# EasyEDA schematic SCH_Trabalho-AP1-Somador_2024-10-15.json
TITLE: Daniel Studart, Davi Jacob e João Paulo Dopcke; REV: 1.0; Date: 2024-08-28; Sheet: 1/1; Company: IBMEC
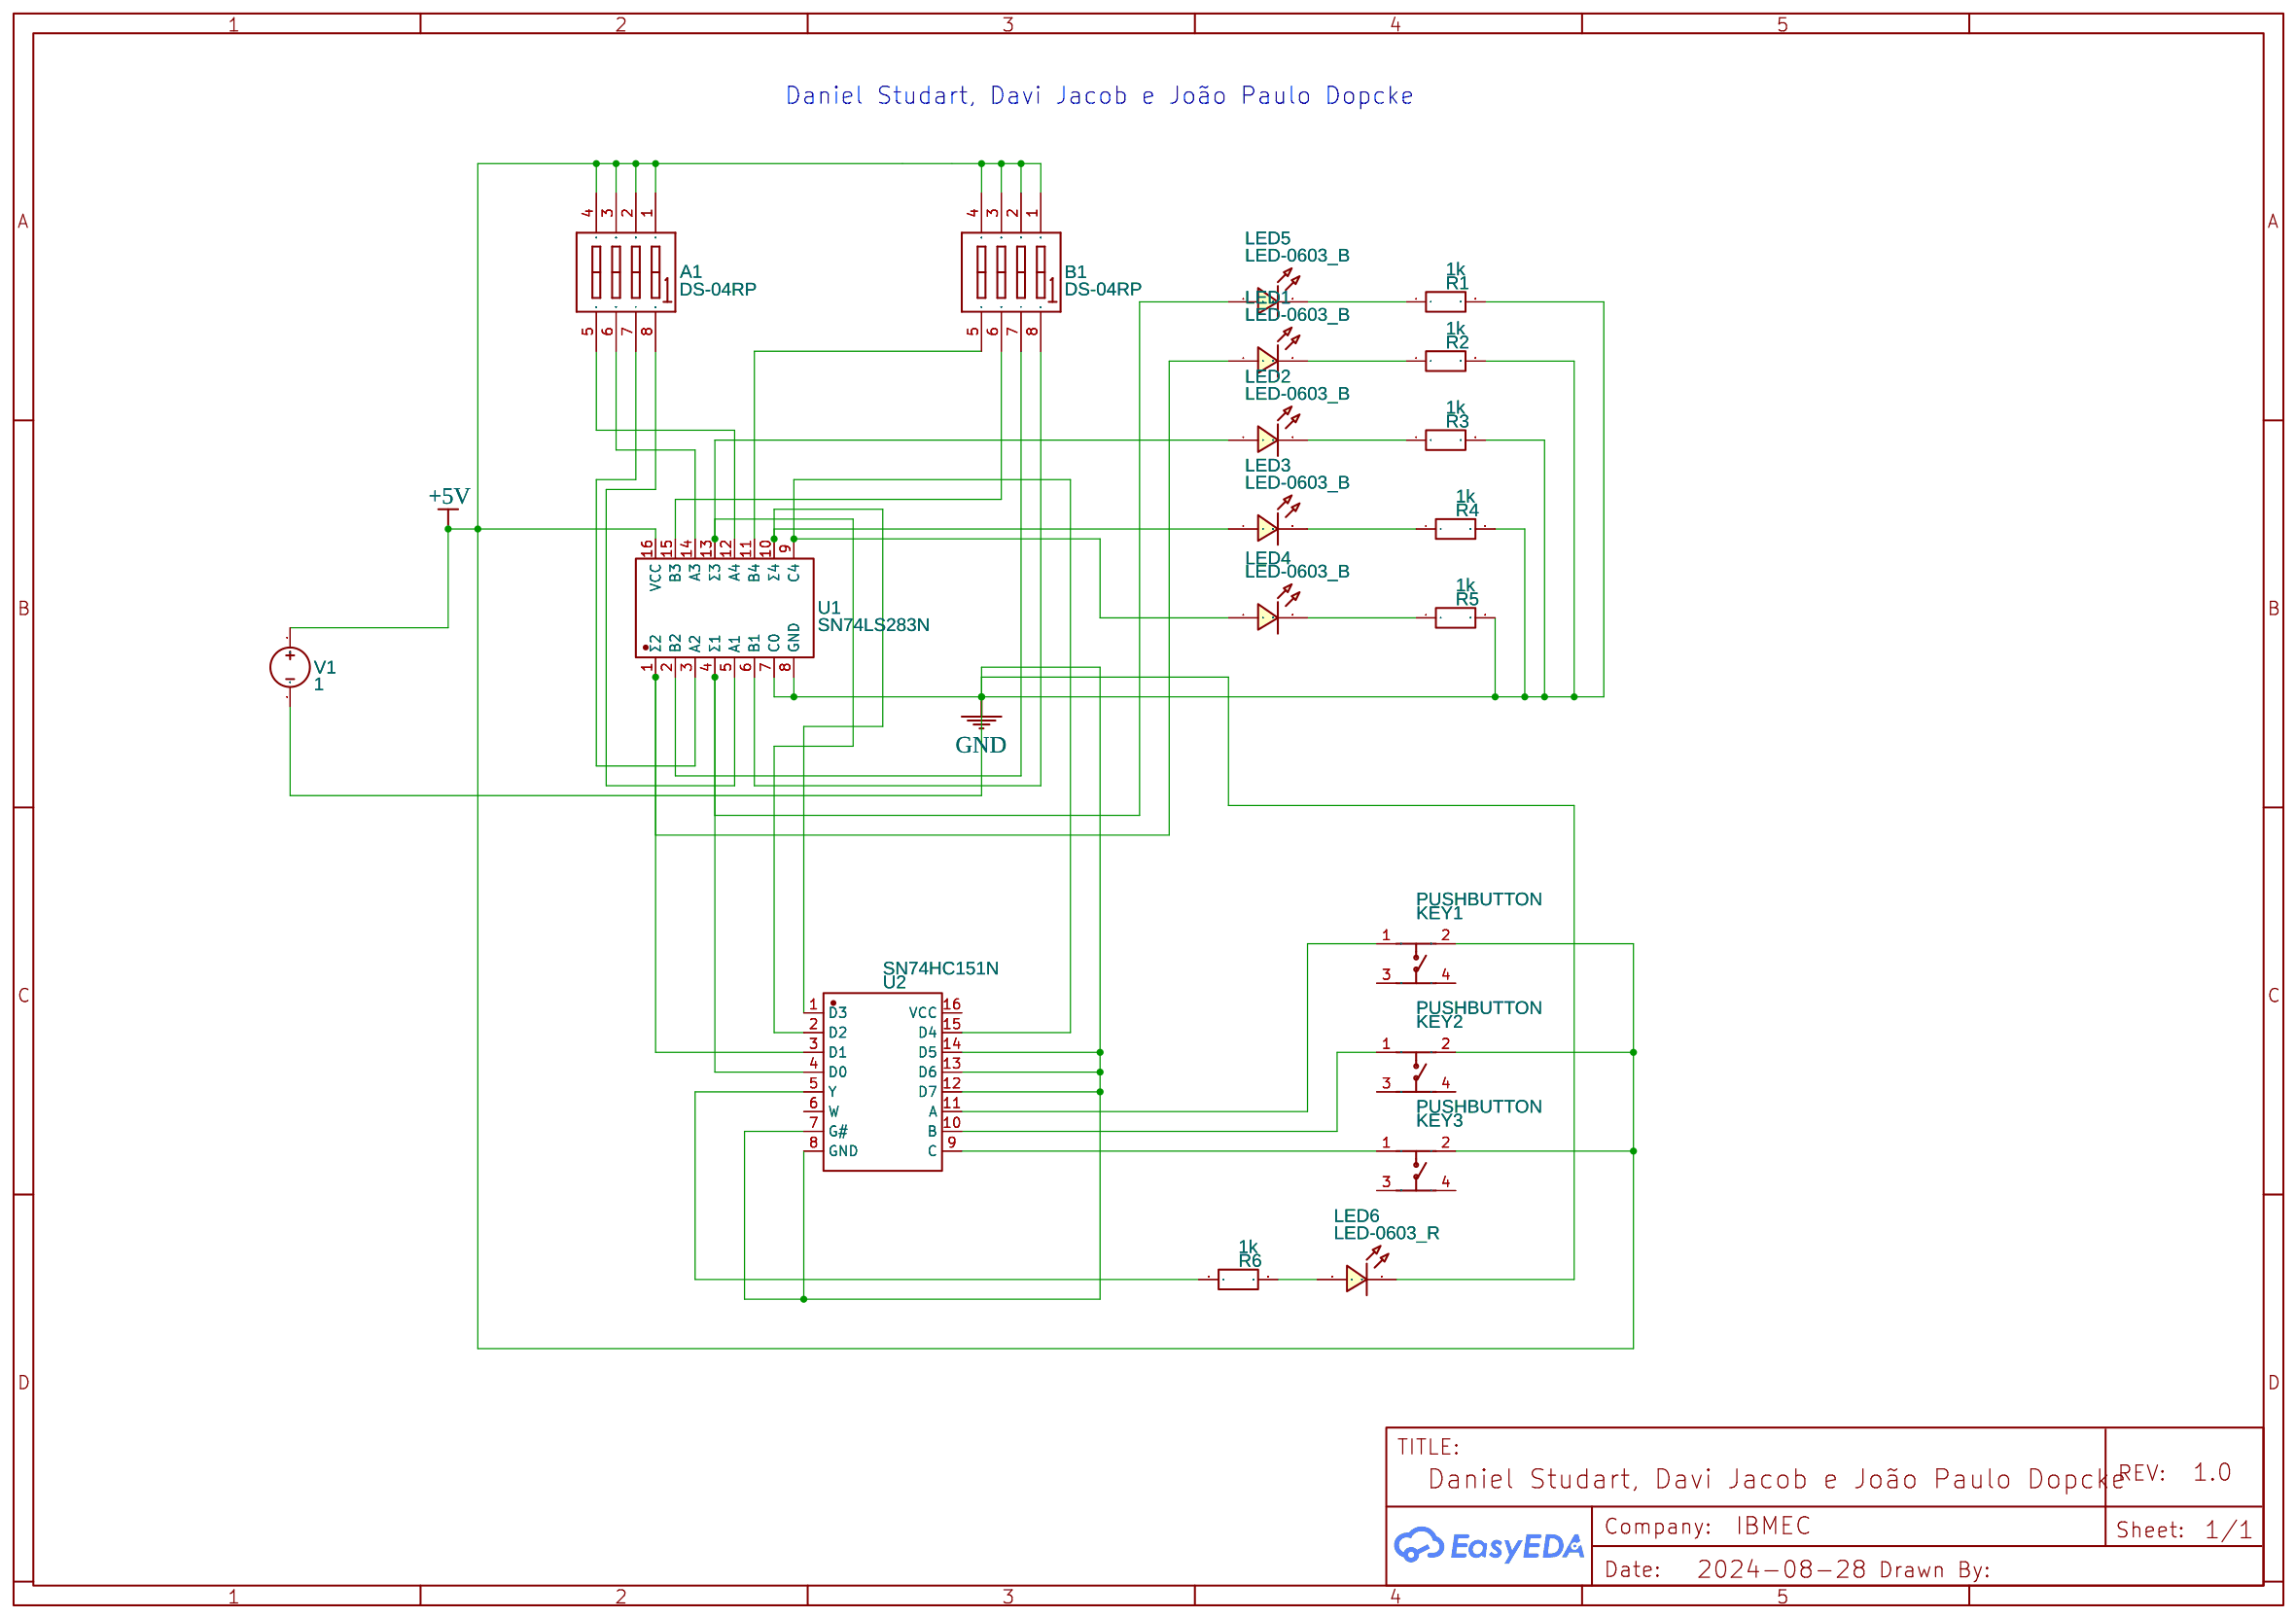
[diagram p0: schematic sheet]

## Parts
A1  DS-04RP  [SW-TH_DS-04XP]
B1  DS-04RP  [SW-TH_DS-04XP]
KEY1  PUSHBUTTON  [SW-SMD_4P-L6.0-W6.0-P4.50-LS10.0_TL3301EF160QG]
KEY2  PUSHBUTTON  [SW-SMD_4P-L6.0-W6.0-P4.50-LS10.0_TL3301EF160QG]
KEY3  PUSHBUTTON  [SW-SMD_4P-L6.0-W6.0-P4.50-LS10.0_TL3301EF160QG]
LED1  LED-0603_B  [LED0603_BLUE]
LED2  LED-0603_B  [LED0603_BLUE]
LED3  LED-0603_B  [LED0603_BLUE]
LED4  LED-0603_B  [LED0603_BLUE]
LED5  LED-0603_B  [LED0603_BLUE]
LED6  LED-0603_R  [LED0603_RED]
R1  1k  [R0603]
R2  1k  [R0603]
R3  1k  [R0603]
R4  1k  [R0603]
R5  1k  [R0603]
R6  1k  [R0603]
U1  SN74LS283N  [PDIP-16_L19.3-W6.4-P2.54-LS7.94-BL]
U2  SN74HC151N  [PDIP-16_L19.7-W6.6-P2.54-LS7.8-BL]
V1  1  [HDR1X2]

## Library data of the parts
A1 B1 = DS-04RP: Supplier: LCSC; Manufacturer: 韩国韩荣; Supplier Part: C92645; JLCPCB Part Class: Extended Part
KEY1-KEY3 = 4PINTACTPCBTHTPUSHBUTTON: Contributor: LCSC; Supplier: LCSC; Supplier Part: C9900003768; Manufacturer: null; Manufacturer Part: 4pinTACTPCBTHTPushButton; JLCPCB Part Class: Extended Part
LED1-LED5 = LED-0603_B: Manufacturer: EVERLIGHT(台湾亿光); Manufacturer Part: 19-217/BHC-ZL1M2RY/3T; Supplier Part: C72041; Supplier: LCSC; Contributor: LCEDA_01
LED6 = LED-0603_R: Manufacturer: EVERLIGHT(台湾亿光); Manufacturer Part: 19-217/R6C-AL1M2VY/3T; Supplier Part: C72044; Supplier: LCSC; Contributor: LCEDA_01
R1-R6 = R_0603_EU: Contributor: LCEDA_Lib
U1 = SN74LS283N: Contributor: LCSC; Supplier: LCSC; Supplier Part: C1523494; Manufacturer: TI(德州仪器); JLCPCB Part Class: Extended Part
U2 = SN74HC151N: Contributor: LCSC; Supplier: LCSC; Supplier Part: C157528; Manufacturer: TI(德州仪器)
V1 = VDC: Contributor: EasyEDA; sim: true

## Nets
+5V: A1.1(A1) A1.2(A2) A1.3(A3) A1.4(A4) B1.1(A1) B1.2(A2) B1.3(A3) B1.4(A4) KEY1.2 KEY2.2 KEY3.2 U1.16(VCC) V1.1
GND: LED6.2 R1.2 R2.2 R3.2 R4.2 R5.2 U1.7(C0) U1.8(GND) U2.7(G#) U2.8(GND) U2.12(D7) U2.13(D6) U2.14(D5) V1.2
Net-(A1-5): A1.5 U1.12(A4)
Net-(A1-6): A1.6 U1.14(A3)
Net-(A1-7): A1.7 U1.3(A2)
Net-(A1-8): A1.8 U1.5(A1)
Net-(B1-5): B1.5 U1.11(B4)
Net-(B1-6): B1.6 U1.15(B3)
Net-(B1-7): B1.7 U1.2(B2)
Net-(B1-8): B1.8 U1.6(B1)
Net-(KEY1-1): KEY1.1 U2.11(A)
Net-(KEY2-1): KEY2.1 U2.10(B)
Net-(KEY3-1): KEY3.1 U2.9(C)
Net-(LED1-1): LED1.1 U1.1(Σ2) U2.3(D1)
Net-(LED1-2): LED1.2 R2.1
Net-(LED2-1): LED2.1 U1.13(Σ3) U2.2(D2)
Net-(LED2-2): LED2.2 R3.1
Net-(LED3-1): LED3.1 U1.10(Σ4) U2.1(D3)
Net-(LED3-2): LED3.2 R4.1
Net-(LED4-1): LED4.1 U1.9(C4) U2.15(D4)
Net-(LED4-2): LED4.2 R5.1
Net-(LED5-1): LED5.1 U1.4(Σ1) U2.4(D0)
Net-(LED5-2): LED5.2 R1.1
Net-(LED6-1): LED6.1 R6.2
Net-(R6-1): R6.1 U2.5(Y)

Not connected (* = marked no-connect by the designer): KEY1 3 4; KEY2 3 4; KEY3 3 4; U2 6(W) 16(VCC)

## Notes on the sheet
- Daniel Studart, Davi Jacob e João Paulo Dopcke
